# Altium project Rus.PrjPcb (part 1 of 2)
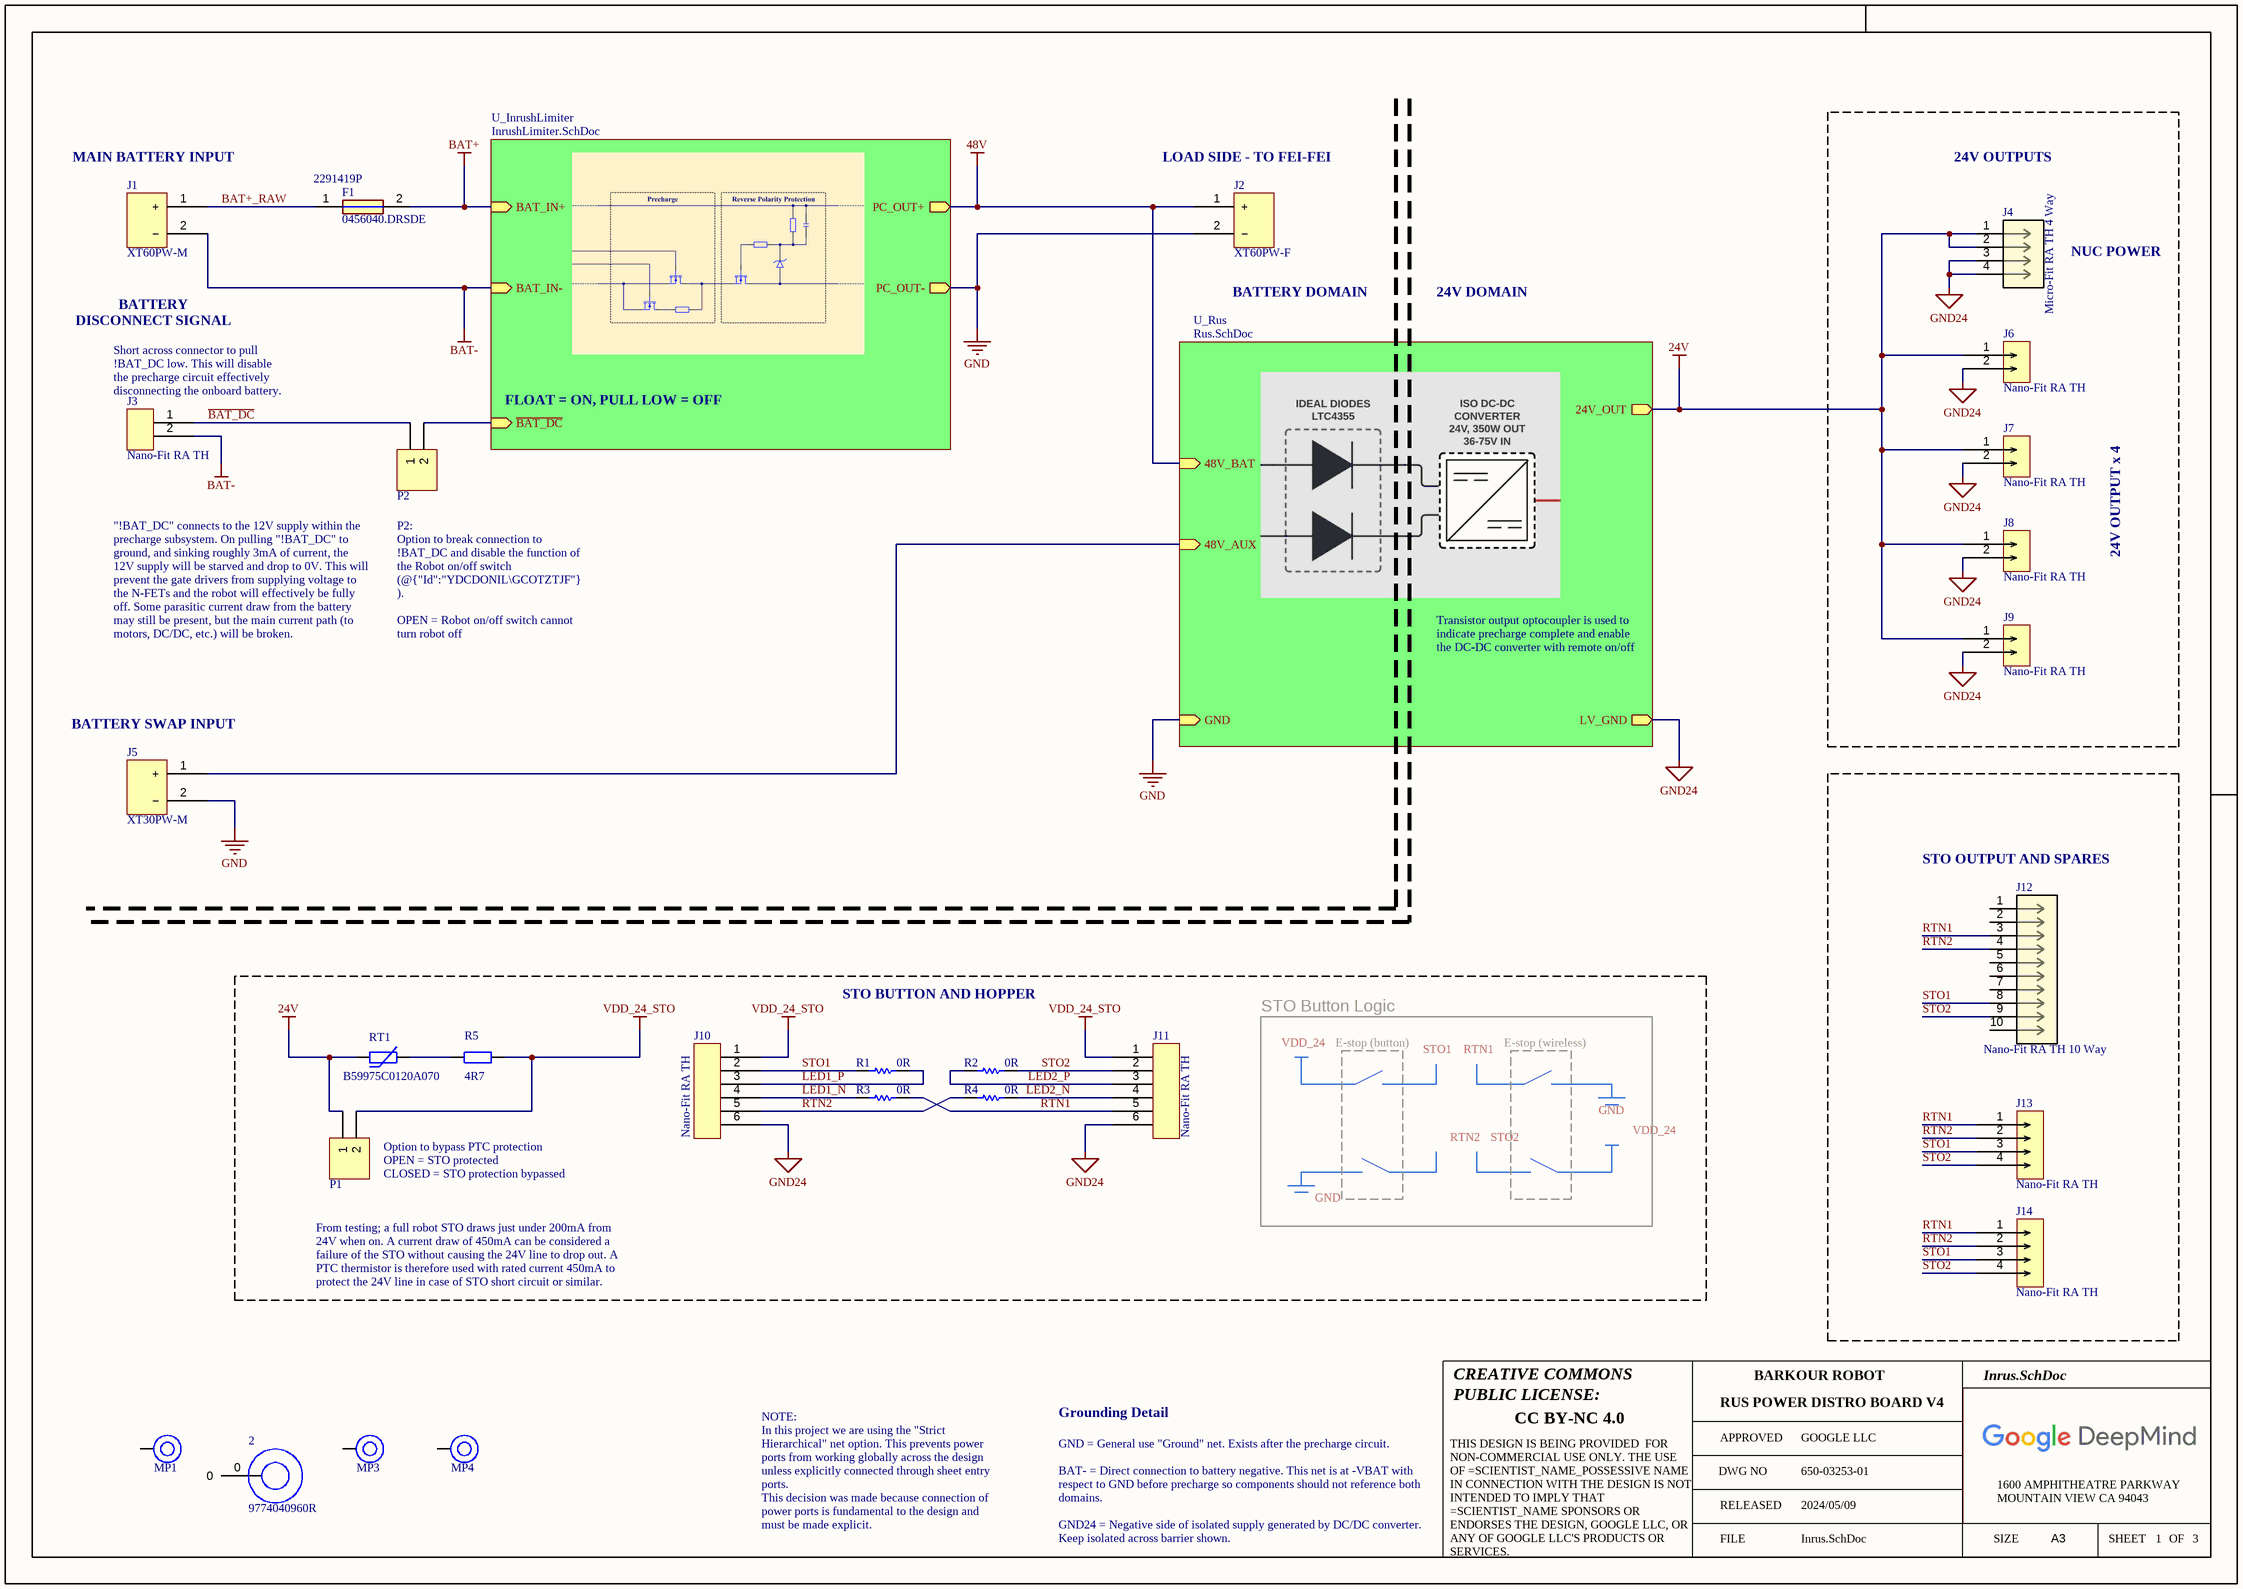
[diagram p0: Inrus.SchDoc]
Scientist_Name_Possessive: DANIELA RUS'S; Scientist_Name: DANIELA RUS; PROJECT_NAME: RUS POWER DISTRO BOARD V4; GPN_PCBA: 650-03253-01
3 sheets, 111 parts. Net scope: strictly hierarchical (ports join the sheet entries above them; power ports are local).
Board file: Rus.PcbDoc
Sheets:
  Inrus.SchDoc
    U_InrushLimiter = InrushLimiter.SchDoc
    U_Rus = Rus.SchDoc

## Sheet Inrus.SchDoc
size 420 x 297 mm; SheetNumber: 1; SheetTotal: 3

### Parts
2  9774040960R  [9774040960R]
F1  0456040.DRSDE  Supplier Part Number 1: 2291419P  [FUSC12245X450N]
J1  XT60PW-M  [XT60PW_M]
J2  XT60PW-F  [XT60PW_F]
J3  Colloquial: Nano-Fit RA TH  [MOLEX 1053131102]  (hidden comment: 105313-1202)
J4  Colloquial: Micro-Fit RA TH 4 Way  [MOLEX 430450401]  (hidden comment: 430450401)
J5  XT30PW-M  [XT30PW_M]
J6  Colloquial: Nano-Fit RA TH  [MOLEX 1053131102]  (hidden comment: 105313-1202)
J7  Colloquial: Nano-Fit RA TH  [MOLEX 1053131102]  (hidden comment: 105313-1202)
J8  Colloquial: Nano-Fit RA TH  [MOLEX 1053131102]  (hidden comment: 105313-1202)
J9  Colloquial: Nano-Fit RA TH  [MOLEX 1053131102]  (hidden comment: 105313-1202)
J10  Colloquial: Nano-Fit RA TH  [MOLEX 1053141206]  (hidden comment: 105314-1206)
J11  Colloquial: Nano-Fit RA TH  [MOLEX 1053141206]  (hidden comment: 105314-1206)
J12  Colloquial: Nano-Fit RA TH 10 Way  [MOLEX 1053141110]  (hidden comment: 1053141310)
J13  Colloquial: Nano-Fit RA TH  [MOLEX 1053141204]  (hidden comment: 105314-1204)
J14  Colloquial: Nano-Fit RA TH  [MOLEX 1053141204]  (hidden comment: 105314-1204)
MP1  M3 x 4mm  [9774040360]  (value not drawn)
MP3  M3 x 4mm  [9774040360]  (value not drawn)
MP4  M3 x 4mm  [9774040360]  (value not drawn)
P1  Header 2  [HDR1X2]  (value not drawn)
P2  Header 2  [HDR1X2]  (value not drawn)
R1  Resistance: 0R  [RESC1608X55X25ML10T15]  (hidden comment: RC0603JR-070RL)
R2  Resistance: 0R  [RESC1608X55X25ML10T15]  (hidden comment: RC0603JR-070RL)
R3  Resistance: 0R  [RESC1608X55X25ML10T15]  (hidden comment: RC0603JR-070RL)
R4  Resistance: 0R  [RESC1608X55X25ML10T15]  (hidden comment: RC0603JR-070RL)
R5  4R7  [RES 2512_6432]
RT1  B59975C0120A070  [RES THERM TH 9.0x12.5 DISC LEADED]

### Blocks framed on the sheet
STO OUTPUT AND SPARES: J12-J14
STO Button Logic: J10 J11 P1 R1-R5 RT1

### Sub-sheets
U_InrushLimiter = InrushLimiter.SchDoc: BAT_IN+ (in), BAT_IN- (in), PC_OUT+ (out), PC_OUT- (out), ~{BAT_DC} (in)
U_Rus = Rus.SchDoc: 48V_BAT (in), 48V_AUX (in), 24V_OUT (out), LV_GND (out), GND (in)

### Nets
24V: J4.1 J4.2 J6.1 J7.1 J8.1 J9.1 P1.1 RT1.1 ; sheet U_Rus/24V_OUT
48V: F1.2 J2.1(+) ; sheet U_InrushLimiter/BAT_IN+, sheet U_InrushLimiter/PC_OUT+, sheet U_Rus/48V_BAT  [also labelled BAT+]
48V_IN_2: J5.1(+) ; sheet U_Rus/48V_AUX
BAT-: J1.2(−) J3.2 ; sheet U_InrushLimiter/BAT_IN-
GND: J2.2(−) J5.2(−) ; sheet U_InrushLimiter/PC_OUT-, sheet U_Rus/GND
GND24: J4.3 J4.4 J6.2 J7.2 J8.2 J9.2 J10.6 J11.6 ; sheet U_Rus/LV_GND
VDD_24_STO: J10.1 J11.1 P1.2 R5.2
~{BAT_DC}: J3.1 P2.1
BAT+_RAW: F1.1 J1.1(+)
LED1_N: J10.4 R3.2
LED1_P: J10.3 R1.1
LED2_N: J11.4 R4.2
LED2_P: J11.3 R2.1
RTN1: J11.5 J12.3 J13.1 J14.1 R3.1
RTN2: J10.5 J12.4 J13.2 J14.2 R4.1
STO1: J10.2 J12.8 J13.3 J14.3 R1.2
STO2: J11.2 J12.9 J13.4 J14.4 R2.2
NetD202_3: P2.2 ; sheet U_InrushLimiter/~{BAT_DC}
NetR5_1: R5.1 RT1.2

Not connected (* = marked no-connect by the designer): 2 0; J12 1 2 5 6 7 10; MP1 1; MP3 1; MP4 1

### Notes on the sheet
- (near J1) MAIN BATTERY INPUT
- (near J2) LOAD SIDE - TO FEI-FEI
- 24V OUTPUTS
- NUC POWER
- BATTERY DOMAIN
- 24V DOMAIN
- BATTERY DISCONNECT SIGNAL
- (near J3) Short across connector to pull !BAT_DC low. This will disable the precharge circuit effectively disconnecting the onboard battery.
- FLOAT = ON, PULL LOW = OFF
- 24V OUTPUT x 4
- "!BAT_DC" connects to the 12V supply within the precharge subsystem. On pulling "!BAT_DC" to ground, and sinking roughly 3mA of current, the 12V supply will be starved and drop to 0V. This will prevent the gate drivers from supplying voltage to the N-FETs and the robot will effectively be fully off. Some parasitic current draw from the battery may still be present, but the main current path (to motors, DC/DC, etc.) will be broken.
- P2:
  Option to break connection to !BAT_DC and disable the function of the Robot on/off switch (@{"Id":"YDCDONIL\GCOTZTJF"} ).
  OPEN = Robot on/off switch cannot turn robot off
  CLOSED (default) = Robot on/off switch functional
- (near J5) BATTERY SWAP INPUT
- Transistor output optocoupler is used to indicate precharge complete and enable the DC-DC converter with remote on/off
- STO BUTTON AND HOPPER
- VDD_24
- E-stop (button)
- STO1
- RTN1
- E-stop (wireless)
- GND
- (near P1) Option to bypass PTC protection
  OPEN = STO protected
  CLOSED = STO protection bypassed
- RTN2
- STO2
- From testing; a full robot STO draws just under 200mA from 24V when on. A current draw of 450mA can be considered a failure of the STO without causing the 24V line to drop out. A PTC thermistor is therefore used with rated current 450mA to protect the 24V line in case of STO short circuit or similar.
- Grounding Detail
- NOTE:
  In this project we are using the "Strict Hierarchical" net option. This prevents power ports from working globally across the design unless explicitly connected through sheet entry ports.
  This decision was made because connection of power ports is fundamental to the design and must be made explicit.
- GND = General use "Ground" net. Exists after the precharge circuit.
  BAT- = Direct connection to battery negative. This net is at -VBAT with respect to GND before precharge so components should not reference both domains.
  GND24 = Negative side of isolated supply generated by DC/DC converter. Keep isolated across barrier shown.
- CREATIVE COMMONS
- PUBLIC LICENSE:
- BARKOUR ROBOT
- CC BY-NC 4.0
- APPROVED
- DWG NO
- GOOGLE LLC
- FILE
- RELEASED
- 2024/05/09
- SIZE
- 1600 AMPHITHEATRE PARKWAY
- MOUNTAIN VIEW CA 94043
- A3
- SHEET
- OF
- THIS DESIGN IS BEING PROVIDED  FOR NON-COMMERCIAL USE ONLY. THE USE OF =SCIENTIST_NAME_POSSESSIVE NAME IN CONNECTION WITH THE DESIGN IS NOT INTENDED TO IMPLY THAT =SCIENTIST_NAME SPONSORS OR ENDORSES THE DESIGN, GOOGLE LLC, OR ANY OF GOOGLE LLC'S PRODUCTS OR SERVICES.

### Library data of the parts
2 = 9774040960R: Spacer Material: Steel Mounting: SMT Series: WA-SMST For ø: 3.3 mm; Manufacturer: Wurth Electronics; Plating: Tin; Threaded/Unthreaded: Unthreaded; Inside Diameter: 0.13inch; Outside Diameter: 0.236inch; Supplier 1: Digi-Key; Manufacturer Part Number: 9774040960R; RoHS: Yes; Category: Spacers, Standoffs; Stock 1: 190; Pricing 1: 1=1.79000, 10=1.71600, 50=1.50700, 100=1.40200 (USD); Material: Steel; Length: 0.213inch; REACH SVHC: Unknown; ComponentLink1URL: http://www.farnell.com/datasheets/1960394.pdf?src-supplier=Farnell; ComponentLink1Description: http://www.farnell.com/datasheets/1960394.pdf?src-supplier=Farnell; ComponentLink2URL: http://www.mouser.com/ds/2/445/9774040960R-611108.pdf?src-supplier=Mouser; ComponentLink2Description: http://www.mouser.com/ds/2/445/9774040960R-611108.pdf?src-supplier=Mouser; ComponentLink3URL: https://media.digikey.com/pdf/Data%20Sheets/Wurth%20Electronics%20PDFs/WA-SMSx_Performance_Flyer.pdf?src-supplier=Digi-Key; ComponentLink3Description: https://media.digikey.com/pdf/Data%20Sheets/Wurth%20Electronics%20PDFs/WA-SMSx_Performance_Flyer.pdf?src-supplier=Digi-Key; ComponentLink4URL: http://www.farnell.com/datasheets/1960394.pdf?src-supplier=Element14; ComponentLink4Description: http://www.farnell.com/datasheets/1960394.pdf?src-supplier=Element14; ComponentLink5URL: http://www.farnell.com/datasheets/1960394.pdf?src-supplier=Newark; ComponentLink5Description: http://www.farnell.com/datasheets/1960394.pdf?src-supplier=Newark; Supplier Part Number 1: 732-7092-1-ND
F1 = 0456040.DRSDE: Electric Fuse, Fast Blow, 40A, 250VAC, 80VDC, 150A (IR), Surface Mount, NANO; Manufacturer_Name: LITTELFUSE; Datasheet Link: https://www.littelfuse.com/~/media/electronics/datasheets/fuses/littelfuse_fuse_456sde_datasheet.pdf.pdf; Height: 4.5mm; Manufacturer_Part_Number: 0456040.DRSDE; Mouser Part Number: 576-0456040.DRSDE; Mouser Price/Stock: https://www.mouser.co.uk/ProductDetail/Littelfuse/0456040.DRSDE?qs=iLbezkQI%252Bsg1J2n4oyxfKg%3D%3D; Supplier 1: Rs; Manufacturer: Littelfuse; Manufacturer Part Number: 0456040.DRSDE; RoHS: Yes; Category: Fuses; Stock 1: 1372; Pricing 1: 50=3.055, 100=2.55, 250=2.475, 500=2.115 (GBP)
J1 = XT60PW-M: Amass XT60 RA TH male header; Manufacturer: Amass; Manufacturer Part Number: XT60PW-M
J2 = XT60PW-F: Amass XT60 RA TH female header; Manufacturer: Amass; Manufacturer Part Number: XT60PW-F
J3 J6-J9 = Nano-Fit RA TH 2 Way Header: Nano-Fit Right Angle Header; Through Hole; 2.50mm; Single Row; 2 Circuit; Gold Plated; Manufacturer: Molex; Gender: Male; Supplier 1: RSComponents; Manufacturer Part Number: 105313-1202; RoHS: Yes; Category: Headers and Wire Housings; Stock 1: 621; Pricing 1: 10=1.38000 (GBP); Mount: Through Hole; Contact Plating: Gold; Contact Material: Brass; Color: Black; Termination: Through Hole; Number of Rows: 1; REACH SVHC: Unknown; RoHS Compliant: Yes; Supplier Part Number 1: 1225087
J4 = Micro-Fit RA TH 4 Way Header Dual Row: Header, 2 Row, Right-Angle, Snap-In Lock, 4 Pin, Gold Plate, SMT/Glow Wire Compatible; Manufacturer: Molex; Copyright: Copyright (C) 2022 Ultra Librarian. All rights reserved.; Manufacturer Part Number: 430450401; RefDes: RefDes; Type: DEV; Supplier 1: RSComponents; RoHS: Yes; Category: Headers and Wire Housings; Stock 1: 2315; Pricing 1: 5=1.54600, 100=1.21000, 375=1.08600, 1500=0.86200, 3000=0.80000 (GBP); ComponentLink1URL: https://datasheet.ciiva.com/5153/0430450401-pcb-headers-142810-5153780.pdf?src-supplier=Mouser; ComponentLink1Description: https://datasheet.ciiva.com/5153/0430450401-pcb-headers-142810-5153780.pdf?src-supplier=Mouser; ComponentLink2URL: https://datasheet.ciiva.com/31838/151680430450401-pcb-headers-31838471.pdf?src-supplier=Onlinecomponents.com; ComponentLink2Description: https://datasheet.ciiva.com/31838/151680430450401-pcb-headers-31838471.pdf?src-supplier=Onlinecomponents.com; ComponentLink3URL: https://datasheet.ciiva.com/11749/0900766b80d483ee-11749369.pdf?src-supplier=RSComponents; ComponentLink3Description: https://datasheet.ciiva.com/11749/0900766b80d483ee-11749369.pdf?src-supplier=RSComponents; ComponentLink4URL: https://datasheet.ciiva.com/10090/0430450401-pcb-headers-10090512.pdf?src-supplier=Avnet; ComponentLink4Description: https://datasheet.ciiva.com/10090/0430450401-pcb-headers-10090512.pdf?src-supplier=Avnet; ComponentLink5URL: https://datasheet.ciiva.com/1443/1780486-1443445.pdf?src-supplier=Element14; ComponentLink5Description: https://datasheet.ciiva.com/1443/1780486-1443445.pdf?src-supplier=Element14; Supplier Part Number 1: 6700321
J5 = XT30PW-M: Amass XT30 RA TH male header; Manufacturer: Amass; Manufacturer Part Number: XT30PW-M
J10 J11 = Nano-Fit RA TH 6 Way Header Dual Row: Nano-Fit Right Angle Header; Through Hole; 2.50mm; Dual Row; 6 Circuit; Gold Plated; Manufacturer: Molex; Gender: Male; Manufacturer Part Number: 105314-1206; RoHS: Yes; Category: Headers and Wire Housings; Stock 1: 621; Pricing 1: 10=1.38000 (GBP); Mount: Through Hole; Contact Plating: Gold; Contact Material: Brass; Color: Black; Termination: Through Hole; Number of Rows: 2; REACH SVHC: Unknown; RoHS Compliant: Yes; Supplier 1: Farnell; Supplier Part Number 1: 2576871
J12 = Nano-Fit RA TH 10 Way Header: Nano-Fit Right Angle Header; Through Hole; 2.50mm; Dual Row; 10 Circuit; Gold Plating; Manufacturer: Molex; Copyright: Copyright (C) 2022 Ultra Librarian. All rights reserved.; Manufacturer Part Number: 1053141310; RefDes: RefDes; Type: DEV
J13 J14 = Nano-Fit RA TH 4 Way Header Dual Row: Nano-Fit Right Angle Header; Through Hole; 2.50mm; Dual Row; 4 Circuit; Gold Plated; Manufacturer Part Number: 105314-1204
MP1 MP3 MP4 = 9774040360R: WA-SMSI SMT Steel Spacer with internal Thread, OD 6mm, M3 x 4mm; Manufacturer: Wurth Elektronik; Inside Diameter: 4.2mm; Surface: Tin; ComponentLink1Description: Website Link; ComponentLink1URL: https://www.we-online.com/redexpert/article/9774040360R?ad; ComponentLink2Description: Datasheet Link; ComponentLink2URL: https://www.we-online.com/redexpert/spec/9774040360R?ad; Manufacturer Part Number: 9774040360R; Category: SMT Spacers; Match Code: WA-SMSI; Mount: Surface Mount; Operating Temperature Max: 150°C; Operating Temperature Min: -55°C; Packaging: Tape and Reel; Height: 4mm; Material: Steel; Outside Diameter: 6mm; Thread Size: M3
P1 P2 = Header 2: Header, 2-Pin; LatestRevisionDate: 17-Jul-2002; LatestRevisionNote: Re-released for DXP Platform.; Publisher: Altium Limited
R1-R4 = CMP-2100-03667-1: Chip Resistor, 0 Ohm, +/- 5%, 0.1 W, -55 to 155 degC, 0603 (1608 Metric), RoHS, Tape and Reel; Manufacturer: Yageo; Temperature Coefficient: 200ppm/degreesC; Voltage Rating: 50V; Power Rating: 100mW; Width: 0.8mm; Max Operating Temperature: 155degC; Tolerance: 5%; Package Reference: 0603; Height: 0.45mm; Depth: 0.8mm; Package Description: 2-Pin Surface Mount Device, Body 1.6 x 0.8 mm; Termination: SMD/SMT; Package Quantity: 5000; Case/Package: 0603; Case Code (Imperial): 0603; Radiation Hardening: No; Number of Pins: 2; Length: 1.6mm; Lead Free: LeadFree; Voltage Rating (DC): 50V; Military Standard: Not; Datasheet URL: http://www.yageo.com/NewPortal/yageodocoutput?fileName=/pdf/R-Chip/PYu-RC_Group_51_RoHS_L_5.pdf; Manufacturer URL: http://www.yageo.com/; Packaging: TapeandReel; Case Code (Metric): 1608; Min Operating Temperature: -55degC; Composition: ThickFilm; RoHSCompliant: true; Contact Plating: Tin; Datasheet Version: Rev. 5, 10/2016; REACH SVHC: NoSVHC
R5 = R: Generic Resistor; Tolerance: 1%; Voltage Rating: 200V; Power Rating: 1000mW; Temperature Coefficient: 100ppm/°C; Size Code: 2512; Resistance: 4R7
RT1 = B59975C0120A070: Thermistor PTC 1.8 Ohm 25% 2-Pin Radial Cardboard Strip; Manufacturer: Epcos; Max Supply Voltage: 30V; Lead Length: 25mm; Manufacturer Part Number: B59975C0120A070; Supplier 1: Farnell; RoHS: Yes; Category: PTC Resettable Fuses; Stock 1: 1677; Pricing 1: 1=1.56000, 10=1.23000, 50=0.92700, 100=0.83300, 200=0.72800, 500=0.62200, 2500=0.61000 (GBP); Mount: Through Hole; Case/Package: Radial; Number of Pins: 2; Contact Plating: Tin; Min Operating Temperature: -40°C; Max Operating Temperature: 125°C; Packaging: Strip; Tolerance: 25%; Operating Supply Voltage: 30V; Width: 9mm; Height: 12.5mm; Depth: 3.5mm; Thickness: 3.5mm; Radiation Hardening: No; REACH SVHC: No SVHC; Lead Free: Lead Free; RoHS Compliant: Yes; ComponentLink1URL: https://datasheet.ciiva.com/15097/getdatasheetpartid-382302-15097925.pdf?src-supplier=Verical; ComponentLink1Description: https://datasheet.ciiva.com/15097/getdatasheetpartid-382302-15097925.pdf?src-supplier=Verical; ComponentLink2URL: https://datasheet.ciiva.com/48779/1899685-48779500.pdf?src-supplier=Element14; ComponentLink2Description: https://datasheet.ciiva.com/48779/1899685-48779500.pdf?src-supplier=Element14; Supplier Part Number 1: 9753087

## Sheet InrushLimiter.SchDoc
size 420 x 297 mm; SheetNumber: 2; SheetTotal: 3
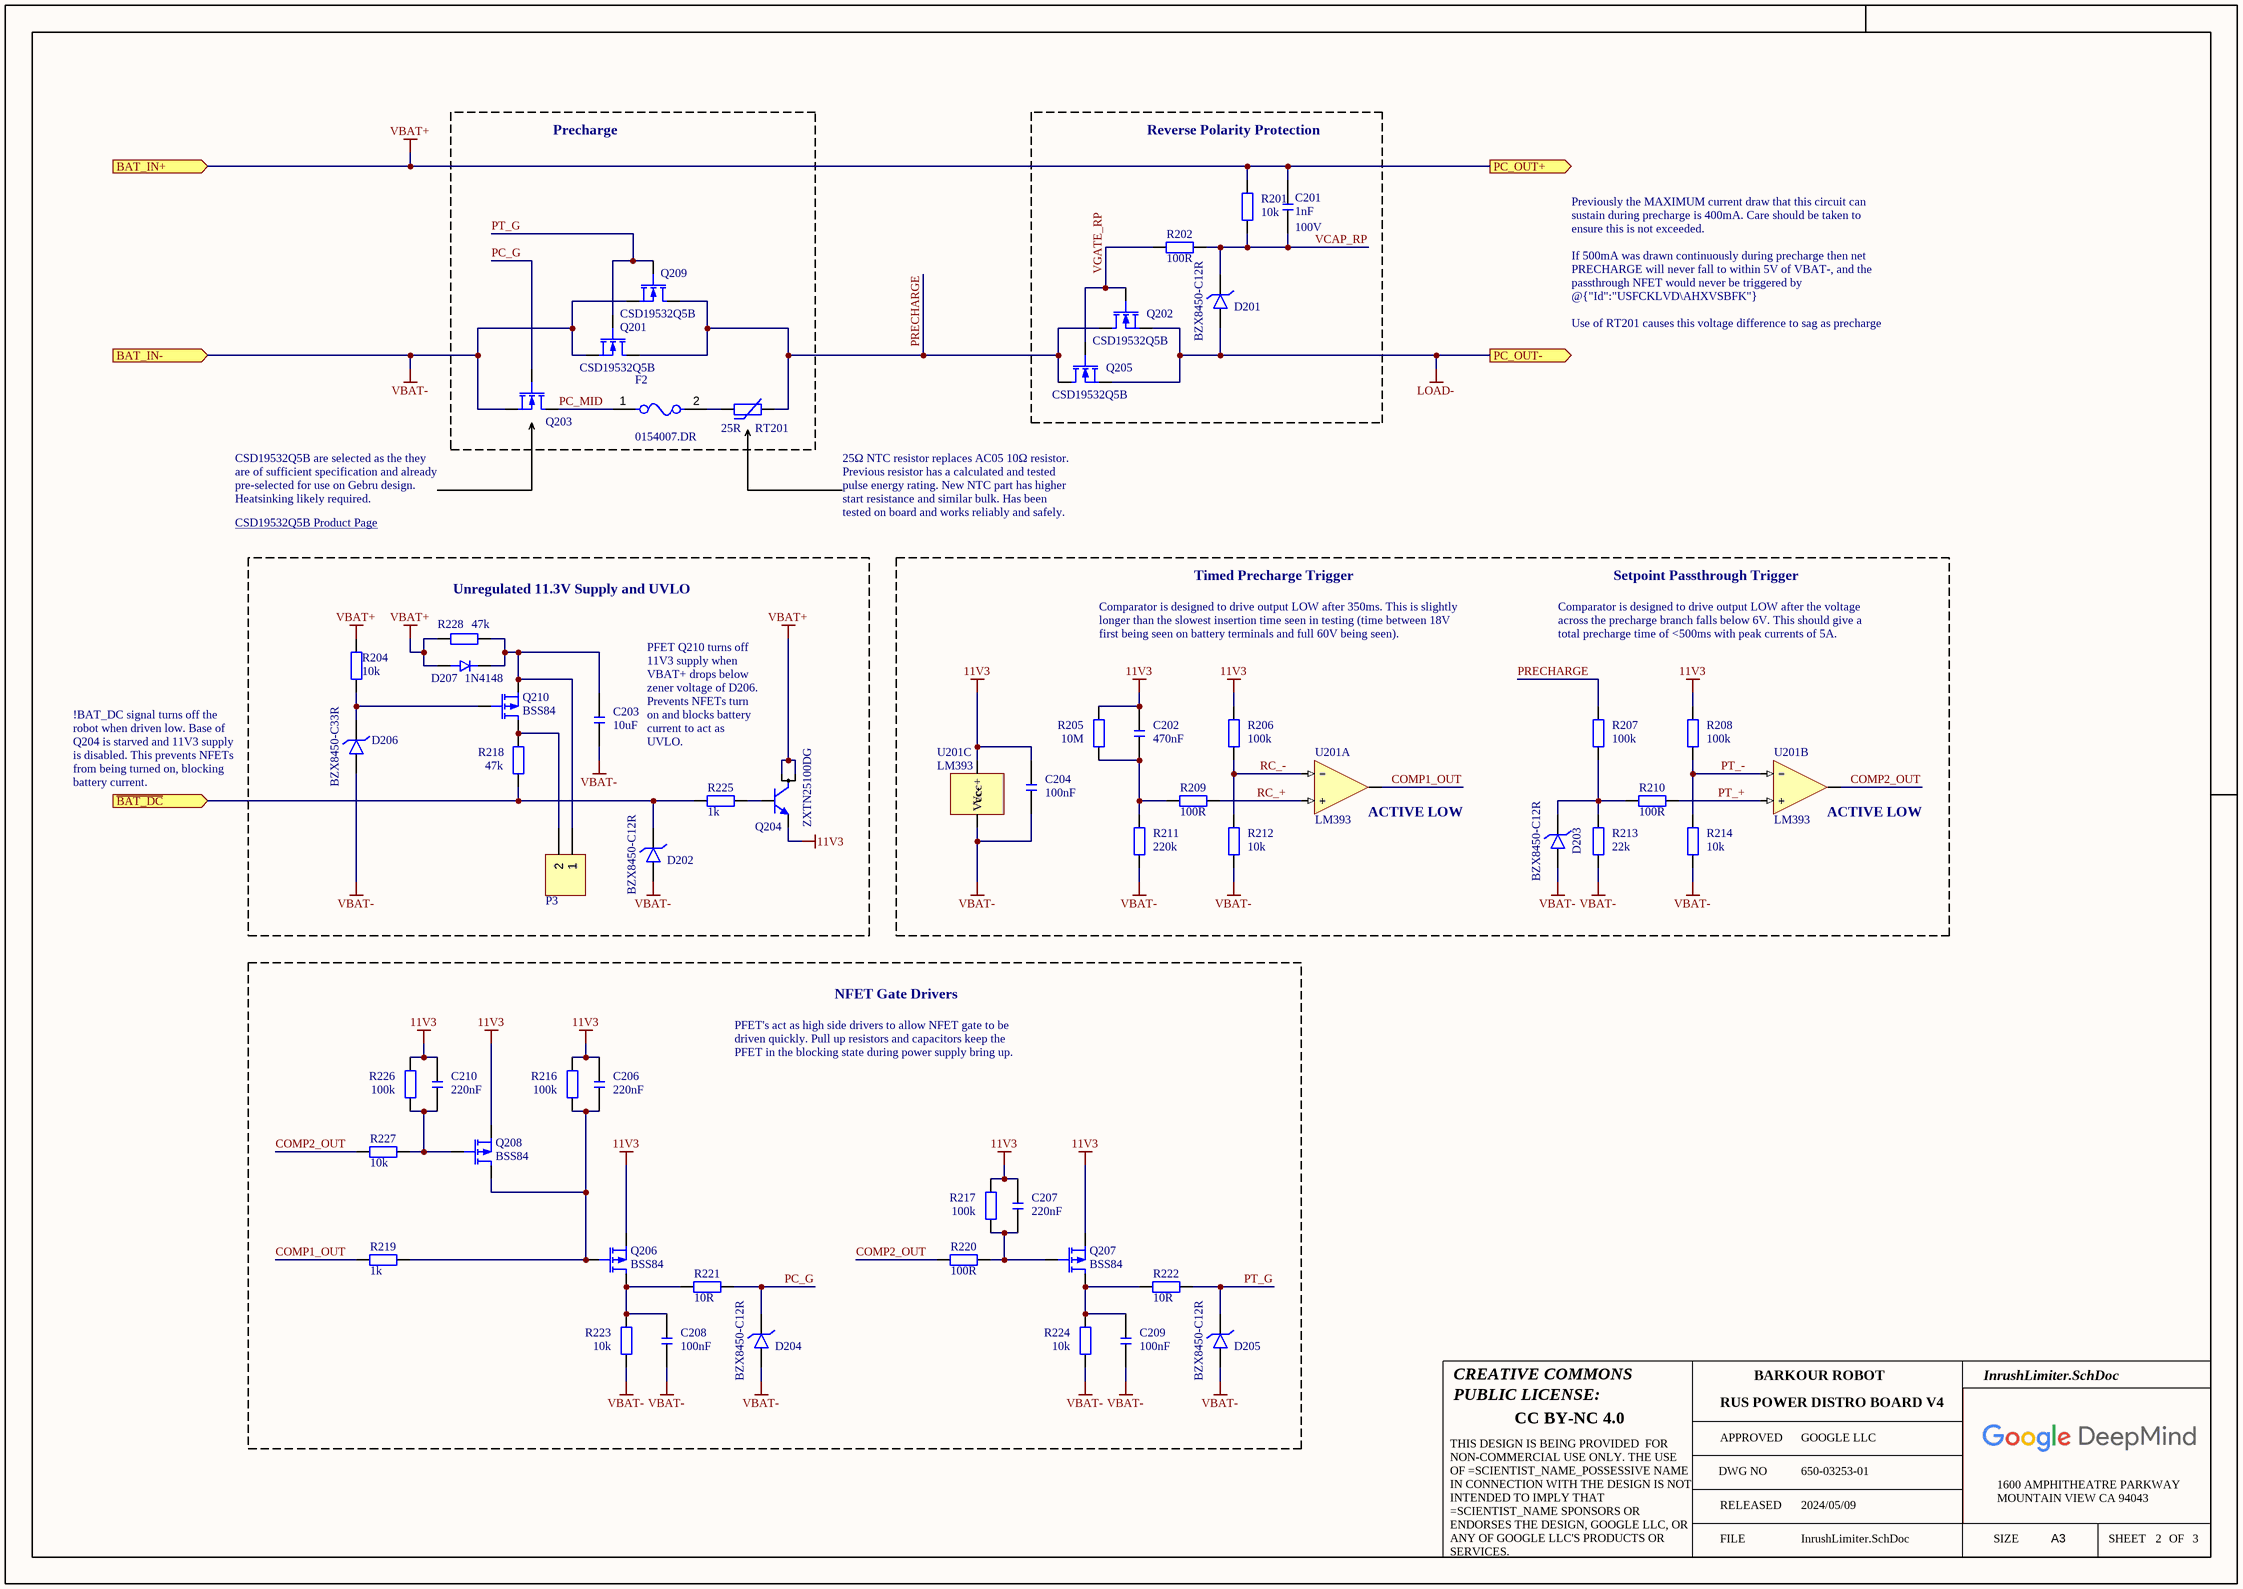
[diagram p1: InrushLimiter.SchDoc]

### Parts
C201  1nF  Voltage Rating: 100V  [CAP 0805_2012]
C202  470nF  [CAP 0603_1608 RF]
C203  10uF  [CAP 1206_3216]
C204  100nF  [CAP 0603_1608 RF]
C206  220nF  [CAP 0603_1608 RF]
C207  220nF  [CAP 0603_1608 RF]
C208  100nF  [CAP 0603_1608 RF]
C209  100nF  [CAP 0603_1608 RF]
C210  220nF  [CAP 0603_1608 RF]
D201  BZX8450-C12R  [NEXPERIA SOT-23-3]
D202  BZX8450-C12R  [NEXPERIA SOT-23-3]
D203  BZX8450-C12R  [NEXPERIA SOT-23-3]
D204  BZX8450-C12R  [NEXPERIA SOT-23-3]
D205  BZX8450-C12R  [NEXPERIA SOT-23-3]
D206  BZX8450-C33R  [NEXPERIA SOT-23-3]
D207  1N4148WS-7-F  [SOD323]  (value not drawn)
F2  0154007.DR  [FP-0154-MFG]
P3  Header 2  [HDR1X2]  (value not drawn)
Q201  CSD19532Q5B  [TI SON 5x6]
Q202  CSD19532Q5B  [TI SON 5x6]
Q203  CSD19532Q5B  [TI SON 5x6]  (value not drawn)
Q204  ZXTN25100DG  [DIODES SOT-223]
Q205  CSD19532Q5B  [TI SON 5x6]
Q206  Colloquial: BSS84  [DIODES SOT-323-3]  (hidden comment: BSS84W-7-F)
Q207  Colloquial: BSS84  [DIODES SOT-323-3]  (hidden comment: BSS84W-7-F)
Q208  Colloquial: BSS84  [DIODES SOT-323-3]  (hidden comment: BSS84W-7-F)
Q209  CSD19532Q5B  [TI SON 5x6]
Q210  Colloquial: BSS84  [DIODES SOT-323-3]  (hidden comment: BSS84W-7-F)
R201  10k  [RES 0402_1005 RF]
R202  100R  [RES 0402_1005 RF]
R204  10k  [RES 0603_1608 RF]
R205  10M  [RES 0402_1005 RF]
R206  100k  [RES 0402_1005 RF]
R207  100k  [RES 0402_1005 RF]
R208  100k  [RES 0402_1005 RF]
R209  100R  [RES 0402_1005 RF]
R210  100R  [RES 0402_1005 RF]
R211  220k  [RES 0402_1005 RF]
R212  10k  [RES 0402_1005 RF]
R213  22k  [RES 0603_1608 RF]
R214  10k  [RES 0402_1005 RF]
R216  100k  [RES 0402_1005 RF]
R217  100k  [RES 0402_1005 RF]
R218  47k  [RES 0603_1608 RF]
R219  1k  [RES 0402_1005 RF]
R220  100R  [RES 0402_1005 RF]
R221  10R  [RES 0402_1005 RF]
R222  10R  [RES 0402_1005 RF]
R223  10k  [RES 0402_1005 RF]
R224  10k  [RES 0402_1005 RF]
R225  1k  [RES 0603_1608 RF]
R226  100k  [RES 0402_1005 RF]
R227  10k  [RES 0402_1005 RF]
R228  47k  [RES 0603_1608 RF]
RT201  value 25R  [RES THERM TH 16.0 DISC LEADED]  (hidden comment: B57238S0250M000)
U201  LM393PT  [ST TSSOP-8]  (value not drawn)  (parts A,B,C of 3)

### Blocks framed on the sheet
Precharge: F2 Q201 Q203 Q209 RT201
Reverse Polarity Protection: C201 D201 Q202 Q205 R201 R202
Unregulated 11.3V Supply and UVLO: C203 D202 D206 D207 P3 Q204 Q210 R204 R218 R225 R228
NFET Gate Drivers: C206-C210 D204 D205 Q206-Q208 R216 R217 R219-R224 R226 R227

### Ports
BAT_IN+ (in), BAT_IN- (in), PC_OUT+ (out), PC_OUT- (out), ~{BAT_DC} (in)

### Nets
11V3: C202.2 C204.2 C206.2 C207.2 C210.2 Q204.3(E) Q206.3(S) Q207.3(S) Q208.3(S) R205.2 R206.2 R208.2 R216.1 R217.1 R226.1 U201.8(Vcc+)
LOAD-: D201.1(A) Q202.2(S) Q205.2(S) ; port PC_OUT-  [project net GND]
VBAT+: C201.2 D207.1 Q204.2(C) Q204.4(C) R201.2 R204.1 R228.2 ; port BAT_IN+, port PC_OUT+  [project net 48V]
VBAT-: C203.1 C204.1 C208.1 C209.1 D202.1(A) D203.1(A) D204.1(A) D205.1(A) D206.1(A) Q201.2(S) Q203.2(S) Q209.2(S) R211.1 R212.1 R213.1 R214.1 R223.2 R224.2 U201.4(Vcc-) ; port BAT_IN-  [project net BAT-]
COMP1_OUT: R219.2 U201.1(Out1)
COMP2_OUT: R220.2 R227.2 U201.7(Out1)
PC_G: D204.3(K) Q203.1(G) R221.1
PC_MID: F2.1 Q203.3(D)
PRECHARGE: Q201.3(D) Q202.3(D) Q205.3(D) Q209.3(D) R207.2 RT201.2
PT_+: R210.1 U201.5(+)
PT_-: R208.1 R214.2 U201.6(−)
PT_G: D205.3(K) Q201.1(G) Q209.1(G) R222.1
RC_+: R209.1 U201.3(+)
RC_-: R206.1 R212.2 U201.2(−)
VCAP_RP: C201.1 D201.3(K) R201.1 R202.1
VGATE_RP: Q202.1(G) Q205.1(G) R202.2
NetC202_1: C202.1 R205.1 R209.2 R211.2
NetC203_2: C203.2 D207.2 P3.1 Q210.3(S) R228.1
NetC206_1: C206.1 Q206.1(G) Q208.2(D) R216.2 R219.1
NetC207_1: C207.1 Q207.1(G) R217.2 R220.1
NetC208_2: C208.2 Q206.2(D) R221.2 R223.1
NetC209_2: C209.2 Q207.2(D) R222.2 R224.1
NetC210_1: C210.1 Q208.1(G) R226.2 R227.1
NetD202_3: D202.3(K) R218.1 R225.2 ; port ~{BAT_DC}
NetD203_3: D203.3(K) R207.1 R210.2 R213.2
NetD206_3: D206.3(K) Q210.1(G) R204.2
NetF2_2: F2.2 RT201.1
NetP3_2: P3.2 Q210.2(D) R218.2
NetQ204_1: Q204.1(B) R225.1

### Notes on the sheet
- Previously the MAXIMUM current draw that this circuit can sustain during precharge is 400mA. Care should be taken to ensure this is not exceeded.
  If 500mA was drawn continuously during precharge then net PRECHARGE will never fall to within 5V of VBAT-, and the passthrough NFET would never be triggered by @{"Id":"USFCKLVD\AHXVSBFK"}
  Use of RT201 causes this voltage difference to sag as precharge continues, providing resiliency against this failure mode.
- CSD19532Q5B are selected as the they are of sufficient specification and already pre-selected for use on Gebru design. Heatsinking likely required.
- CSD19532Q5B Product Page <https://www.ti.com/product/CSD19532Q5B>
- 25Ω NTC resistor replaces AC05 10Ω resistor. Previous resistor has a calculated and tested pulse energy rating. New NTC part has higher start resistance and similar bulk. Has been tested on board and works reliably and safely.
- Timed Precharge Trigger
- Setpoint Passthrough Trigger
- Comparator is designed to drive output LOW after 350ms. This is slightly longer than the slowest insertion time seen in testing (time between 18V first being seen on battery terminals and full 60V being seen).
- Comparator is designed to drive output LOW after the voltage across the precharge branch falls below 6V. This should give a total precharge time of <500ms with peak currents of 5A.
- PFET Q210 turns off 11V3 supply when VBAT+ drops below zener voltage of D206. Prevents NFETs turn on and blocks battery current to act as UVLO.
- !BAT_DC signal turns off the robot when driven low. Base of Q204 is starved and 11V3 supply is disabled. This prevents NFETs from being turned on, blocking battery current.
- (near U201) ACTIVE LOW
- PFET's act as high side drivers to allow NFET gate to be driven quickly. Pull up resistors and capacitors keep the PFET in the blocking state during power supply bring up.
- CREATIVE COMMONS
- PUBLIC LICENSE:
- BARKOUR ROBOT
- CC BY-NC 4.0
- APPROVED
- DWG NO
- GOOGLE LLC
- FILE
- RELEASED
- 2024/05/09
- SIZE
- 1600 AMPHITHEATRE PARKWAY
- MOUNTAIN VIEW CA 94043
- A3
- SHEET
- OF
- THIS DESIGN IS BEING PROVIDED  FOR NON-COMMERCIAL USE ONLY. THE USE OF =SCIENTIST_NAME_POSSESSIVE NAME IN CONNECTION WITH THE DESIGN IS NOT INTENDED TO IMPLY THAT =SCIENTIST_NAME SPONSORS OR ENDORSES THE DESIGN, GOOGLE LLC, OR ANY OF GOOGLE LLC'S PRODUCTS OR SERVICES.

### Library data of the parts
C201 = C: Generic Capacitor; Tolerance: 20%; Temperature Coefficient: X7R; Capacitance: 1nF; Size Code: 0805
C202 C204 C206-C210 = C: Generic Capacitor; Tolerance: 10%; Temperature Coefficient: X7R; Voltage Rating: 50V; Size Code: 0603
  C202: Capacitance: 470nF
  C204 C208 C209: Capacitance: 100nF
  C206 C207 C210: Capacitance: 220nF
C203 = C: Generic Capacitor; Tolerance: 10%; Temperature Coefficient: X7R; Voltage Rating: 25V; Capacitance: 10uF; Size Code: 1206
D201-D205 = BZX8450-C12R: Diode Zener Single 12V 5% 250mW 3-Pin SOT-23 T/R; Manufacturer: Nexperia; Manufacturer Part Number: BZX8450-C12R; Supplier 1: Newark; Stock 1: 2900; Pricing 1: 1=0.22000, 5=0.22000, 10=0.17900, 25=0.15100, 50=0.12200, 100=0.09400, 250=0.07800, 500=0.06200, 1000=0.04200 (USD); ComponentLink1URL: https://datasheet.octopart.com/BZX8450-C12R-Nexperia-datasheet-155371286.pdf?src-supplier=Farnell; ComponentLink1Description: https://datasheet.octopart.com/BZX8450-C12R-Nexperia-datasheet-155371286.pdf?src-supplier=Farnell; Supplier Part Number 1: 73AJ2261
D206 = BZX8450-C20R: Zener Diodes BZX8450-C33/SOT23/TO-236AB; Manufacturer: Nexperia; Manufacturer Part Number: BZX8450-C33R; Supplier 1: Farnell; RoHS: Yes; Category: Zener Diodes; Stock 1: 2750; Pricing 1: 5=0.182, 10=0.149, 100=0.079, 500=0.0517, 1000=0.0273, 5000=0.0268 (GBP); Supplier Part Number 1: 3810767
D207 = 1N4148: Signal Diode VR=75V IF=150mA Trr=4ns P=200mW; Manufacturer: Diodes; Reverse Recovery Time: 4ns; Forward Voltage: 1.25V; Average Rectified Current: 150mA; Max Repetitive Reverse Voltage (Vrrm): 75V; Element Configuration: Single; Forward Current: 300mA; Peak Non-Repetitive Surge Current: 2A; Power Dissipation: 200mW; Max Reverse Current: 1uA; Polarity: Standard; Capacitance: 2pF; Supplier 1: RSComponents; Manufacturer Part Number: 1N4148WS-7-F; RoHS: Yes; Category: Rectifier Diodes; Stock 1: 18000; Pricing 1: 3000=0.03600, 6000=0.03200, 12000=0.02900, 30000=0.02700, 60000=0.02300 (USD); Mount: Surface Mount; Number of Pins: 2; Weight: 0.000173oz; Contact Plating: Tin,Matte; Min Operating Temperature: -65°C; Max Operating Temperature: 150°C; Packaging: Tape and Reel; Max Reverse Voltage (DC): 75V; Recovery Time: 4ns; Package Quantity: 3000; Max Forward Surge Current (Ifsm): 2A; Series: -; Max Surge Current: 2A; Current Rating: 150mA; Voltage Rating (DC): 75V; Output Current: 150mA; Reverse Recovery Time-Max: 4ns; Power Rating: 200mW; Voltage: 75V; Length: 1.8mm; Width: 1.4mm; Height: 1mm; Radiation Hardening: No; Lead Free: Lead Free; RoHS Compliant: Yes; REACH SVHC: No SVHC; Supplier Part Number 1: 9228070; Colloquial: 1N4148
F2 = CMP-08605-000035-1: FUSE BRD MNT 7A 125VAC/VDC 2SMD; Manufacturer: Littelfuse Inc; Max Fuse Ac Voltage: 125V; Fuse Blow Speed: Fast; Manufacturer Part Number: 0154007.DR; Device Class L1: Circuit Protection; Octopart: https://octopart.com/0154007.dr-littelfuse-565863; RoHS: TRUE; Automotive: No; Category: Fuse; Device Class L3: unset; Fuse Current: 7A; Device Class L2: Fuses; Height: 3.81mm; Temperature: -55°C to +125°C; ComponentLink2URL: https://www.littelfuse.com/~/media/electronics/datasheets/fuses/littelfuse_fuse_154_154t_154l_154tl_datasheet.pdf.pdf; Digikey Description: FUSE BRD MNT 7A 125VAC/VDC 2SMD; Package: 0154; Max Fuse Dc Voltage: 125V; Temperature Range High: +125°C; Lead Free: Yes; ComponentLink2Description: Datasheet; Mouser Description: Surface Mount Fuses Fuseblock w/ fuse 7A OMNI BLOK 154; Temperature Range Low: -55°C
P3 = Header 2: Header, 2-Pin; LatestRevisionDate: 17-Jul-2002; LatestRevisionNote: Re-released for DXP Platform.; Publisher: Altium Limited
Q201-Q203 Q205 Q209 = CSD19532Q5B: 100-V, N channel NexFET™ power MOSFET, single SON 5 mm x 6 mm, 4.9 mOhm 8-VSON-CLIP -55 to 150; pin to pad: 1>4 2>1+2+3 3>5+6+7+8; Manufacturer: Texas Instruments; Rds On Max: 4.9mR; Input Capacitance: 4.81nF; Drain to Source Voltage (Vdss): 100V; Continuous Drain Current (ID): 100A; Max Power Dissipation: 3.1W; Rise Time: 6ns; Turn-On Delay Time: 7ns; Turn-Off Delay Time: 22ns; Gate to Source Voltage (Vgs): 20V; Threshold Voltage: 2.6V; Number of Elements: 1; ComponentLink2URL: https://assets.nexperia.com/documents/data-sheet/BSS138PS.pdf?src-supplier=Digi-Key; ComponentLink2Description: https://assets.nexperia.com/documents/data-sheet/BSS138PS.pdf?src-supplier=Digi-Key; Manufacturer Part Number: CSD19532Q5B; ComponentLink1URL: http://www.farnell.com/datasheets/1499179.pdf?src-supplier=Farnell; ComponentLink1Description: http://www.farnell.com/datasheets/1499179.pdf?src-supplier=Farnell; ComponentLink3URL: https://assets.nexperia.com/documents/data-sheet/2N7002.pdf?src-supplier=Digi-Key; ComponentLink3Description: https://assets.nexperia.com/documents/data-sheet/2N7002.pdf?src-supplier=Digi-Key; ComponentLink4URL: http://www.farnell.com/datasheets/1499179.pdf?src-supplier=Newark; ComponentLink4Description: http://www.farnell.com/datasheets/1499179.pdf?src-supplier=Newark; Supplier 1: Mouser; RoHS: Yes; Category: MOSFETs; Pricing 1: 1=2.97000, 10=2.67000, 25=2.52000, 50=2.52000, 100=2.17000, 250=2.10000, 500=1.73000, 1000=1.62000, 2500=1.56000, 10000=1.56000 (USD); Mount: Surface Mount; Number of Pins: 8; Contact Plating: Tin; Min Operating Temperature: -55°C; Max Operating Temperature: 150°C; Packaging: Tape and Reel; Element Configuration: Single; Fall Time: 6ns; Package Quantity: 1; Power Dissipation: 3.1W; Number of Channels: 1; Drain to Source Breakdown Voltage: 100V; Drain to Source Resistance: 4.9mR; Lead Free: Contains Lead; RoHS Compliant: Yes; REACH SVHC: No SVHC; ComponentLink5URL: https://datasheet.ciiva.com/29752/csd19532q5b-29752088.pdf?src-supplier=Digi-Key; ComponentLink5Description: https://datasheet.ciiva.com/29752/csd19532q5b-29752088.pdf?src-supplier=Digi-Key; ComponentLink6URL: https://datasheet.ciiva.com/46430/1857696-46430346.pdf?src-supplier=Element14; ComponentLink6Description: https://datasheet.ciiva.com/46430/1857696-46430346.pdf?src-supplier=Element14; ComponentLink7URL: https://datasheet.ciiva.com/46430/1857696-46430347.pdf?src-supplier=Element14; ComponentLink7Description: https://datasheet.ciiva.com/46430/1857696-46430347.pdf?src-supplier=Element14; ComponentLink8URL: https://datasheet.ciiva.com/29752/csd19532q5b-29752093.pdf?src-supplier=Digi-Key; ComponentLink8Description: https://datasheet.ciiva.com/29752/csd19532q5b-29752093.pdf?src-supplier=Digi-Key; ComponentLink9URL: https://datasheet.ciiva.com/29752/csd19532q5b-29752106.pdf?src-supplier=Digi-Key; ComponentLink9Description: https://datasheet.ciiva.com/29752/csd19532q5b-29752106.pdf?src-supplier=Digi-Key; ComponentLink10URL: https://datasheet.ciiva.com/30021/csd19532q5b-30021946.pdf?src-supplier=Avnet; ComponentLink10Description: https://datasheet.ciiva.com/30021/csd19532q5b-30021946.pdf?src-supplier=Avnet; Supplier Part Number 1: 595-CSD19532Q5B
Q204 = ZXTN25100DG: TRANS NPN 100V 3A SOT223; Manufacturer: Diodes Inc; Max Power Dissipation: 5.3W; Transition Frequency: 175MHz; Collector Base Voltage (VCBO): 180V; Emitter Base Voltage (VEBO): 7V; Number of Elements: 1; Collector Emitter Saturation Voltage: 500mV; Element Configuration: Single; Manufacturer Part Number: ZXTN25100DG; Supplier 1: Arrow Electronics; RoHS: Yes; Category: BJTs; Stock 1: 49000; Pricing 1: 1000=0.25480, 2000=0.22890, 5000=0.21400, 10000=0.21190 (USD); Mount: Surface Mount; Case/Package: SOT-223; Number of Pins: 4; Weight: 0.000282oz; Min Operating Temperature: -55°C; Max Operating Temperature: 150°C; Collector Emitter Voltage (VCEO): 100V; Max Collector Current: 3A; Packaging: Tape and Reel; Collector Emitter Breakdown Voltage: 100V; Max Breakdown Voltage: 100V; Package Quantity: 1000; Frequency: 175MHz; Polarity: NPN; Power Dissipation: 5.3W; Gain Bandwidth Product: 175MHz; Max Frequency: 175MHz; Series: -; Collector-emitter Voltage-Max: 500mV; Length: 6.7mm; Width: 3.7mm; Height: 1.65mm; Radiation Hardening: No; Lead Free: Lead Free; REACH SVHC: No SVHC; RoHS Compliant: Yes; ComponentLink1URL: https://datasheet.ciiva.com/6360/zxtn25100dg-6360033.pdf?src-supplier=Digi-Key; ComponentLink1Description: https://datasheet.ciiva.com/6360/zxtn25100dg-6360033.pdf?src-supplier=Digi-Key; Supplier Part Number 1: ZXTN25100DGTA
Q206-Q208 Q210 = BSS84W: P-Channel 50 V 10 Ohm Enhancement Mode Transistor SOT-323; Manufacturer: Diodes Inc; Continuous Drain Current (ID): 130mA; Turn-Off Delay Time: 18ns; Turn-On Delay Time: 10ns; Gate to Source Voltage (Vgs): 20V; Input Capacitance: 45pF; Max Power Dissipation: 200mW; Rds On Max: 10R; Drain to Source Voltage (Vdss): -50V; Current Rating: -130mA; Drain to Source Resistance: 6R; Element Configuration: Single; Number of Channels: 1; Threshold Voltage: -1.6V; Manufacturer Part Number: BSS84W-7-F; Supplier 1: Arrow Electronics; RoHS: Yes; Category: MOSFETs; Stock 1: 6000; Pricing 1: 3000=0.07350, 6000=0.06460 (USD); Mount: Surface Mount; Case/Package: SOT-323; Number of Pins: 3; Weight: 0.000212oz; Contact Plating: Tin,Matte; Min Operating Temperature: -55°C; Max Operating Temperature: 150°C; Packaging: Tape and Reel; Package Quantity: 3000; Voltage Rating (DC): -50V; Power Dissipation: 200mW; Series: -; Polarity: P-CHANNEL; Number of Elements: 1; On-State Resistance: 10R; Nominal Vgs: -1.6V; Drain-source On Resistance-Max: 10R; Length: 2.2mm; Width: 1.35mm; Height: 1mm; Radiation Hardening: No; RoHS Compliant: Yes; Lead Free: Lead Free; REACH SVHC: No SVHC; ComponentLink1URL: https://datasheet.ciiva.com/19479/1539489-19479838.pdf?src-supplier=Jameco; ComponentLink1Description: https://datasheet.ciiva.com/19479/1539489-19479838.pdf?src-supplier=Jameco; ComponentLink2URL: https://datasheet.ciiva.com/4442/ds30205-79185-4442986.pdf?src-supplier=Mouser; ComponentLink2Description: https://datasheet.ciiva.com/4442/ds30205-79185-4442986.pdf?src-supplier=Mouser; ComponentLink3URL: https://datasheet.ciiva.com/15137/getdatasheetpartid-91759-15137729.pdf?src-supplier=Verical; ComponentLink3Description: https://datasheet.ciiva.com/15137/getdatasheetpartid-91759-15137729.pdf?src-supplier=Verical; ComponentLink4URL: https://datasheet.ciiva.com/8115/ds30205-8115434.pdf?src-supplier=Avnet; ComponentLink4Description: https://datasheet.ciiva.com/8115/ds30205-8115434.pdf?src-supplier=Avnet; ComponentLink5URL: https://datasheet.ciiva.com/17082/bss84w-7-f-17082780.pdf?src-supplier=Allied+Electronics; ComponentLink5Description: https://datasheet.ciiva.com/17082/bss84w-7-f-17082780.pdf?src-supplier=Allied+Electronics; ComponentLink6URL: https://datasheet.ciiva.com/1190/ds30205-1190308.pdf?src-supplier=Element14; ComponentLink6Description: https://datasheet.ciiva.com/1190/ds30205-1190308.pdf?src-supplier=Element14; ComponentLink7URL: https://datasheet.ciiva.com/8115/ds30205-8115325.pdf?src-supplier=Avnet; ComponentLink7Description: https://datasheet.ciiva.com/8115/ds30205-8115325.pdf?src-supplier=Avnet; ComponentLink8URL: https://datasheet.ciiva.com/934/ds30205-934606.pdf?src-supplier=Digi-Key; ComponentLink8Description: https://datasheet.ciiva.com/934/ds30205-934606.pdf?src-supplier=Digi-Key; ComponentLink9URL: https://datasheet.ciiva.com/934/ds30205-934607.pdf?src-supplier=Digi-Key; ComponentLink9Description: https://datasheet.ciiva.com/934/ds30205-934607.pdf?src-supplier=Digi-Key; ComponentLink10URL: https://datasheet.ciiva.com/934/ds30205-934605.pdf?src-supplier=Digi-Key; ComponentLink10Description: https://datasheet.ciiva.com/934/ds30205-934605.pdf?src-supplier=Digi-Key; Supplier Part Number 1: BSS84W-7-F
R201 R202 R205-R212 R214 R216 R217 R219-R224 R226 R227 = R: Generic Resistor; Tolerance: 1%; Voltage Rating: 50V; Power Rating: 62.5mW; Temperature Coefficient: 100ppm/°C; Size Code: 0402
  R201 R212 R214 R223 R224 R227: Resistance: 10k
  R202 R209 R210 R220: Resistance: 100R
  R205: Resistance: 10M
  R206-R208 R216 R217 R226: Resistance: 100k
  R211: Resistance: 220k
  R219: Resistance: 1k
  R221 R222: Resistance: 10R
R204 = R: RES 10K OHM 1% 1/5W 0603; Manufacturer: YAGEO; Manufacturer Part Number: RC0603FR-7W10KL; Voltage Rating: 75V; Power Rating: 0.2W; Temperature Coefficient: 200ppm/°C; Size Code: 0603; Tolerance: 1%; Resistance: 10k
R213 R218 R225 R228 = R: Generic Resistor; Tolerance: 1%; Voltage Rating: 75V; Power Rating: 100mW; Temperature Coefficient: 100ppm/°C; Size Code: 0603
  R213: Resistance: 22k
  R218 R228: Resistance: 47k
  R225: Resistance: 1k
RT201 = B57238S0250M000: NTC Thermistor, 25ohm, Through Hole Mount; Manufacturer: Epcos; Tolerance: 20%; Power: 3.9W; Rated Temperature: 25°C; Thermistor Application: SOFT START; Rated AC Voltage (URac): 265V; Manufacturer Part Number: B57238S0250M000; Supplier 1: Rs; RoHS: Yes; Category: Thermistors; Stock 1: 2155; Pricing 1: 500=0.75700 (GBP); Mounting Technology: Through Hole; Pins: 2; Package Shape: Disk; Terminal Finish: Tin; Min Operating Temperature: -55°C; Max Operating Temperature: 170°C; JESD-609 Code: e3; Resistor Type: NTC THERMISTOR; Packaging: Bulk; Terminal Placement: Radial; Termination: Wire; RoHS Compliant: Yes; Reach SVHC Compliant: No; ComponentLink1URL: https://datasheet.ciiva.com:443/pdfs/VipMasterIC/IC/TDKC/TDKC-S-A0001106310/TDKC-S-A0001106310-1.pdf?src-supplier=IHS+Markit; ComponentLink1Description: https://datasheet.ciiva.com:443/pdfs/VipMasterIC/IC/TDKC/TDKC-S-A0001106310/TDKC-S-A0001106310-1.pdf?src-supplier=IHS+Markit; ComponentLink2URL: http://www.epcos.com/inf/50/db/icl_13/B57238_S238.pdf?src-supplier=Avnet; ComponentLink2Description: http://www.epcos.com/inf/50/db/icl_13/B57238_S238.pdf?src-supplier=Avnet; Supplier Part Number 1: 1857638
U201 = LM393: Comparator Dual 18V/36V 8-Pin TSSOP T/R; Manufacturer: ST; Voltage Gain: 106.02dB; Min Supply Voltage: 2V; Max Supply Voltage: 36V; Min Dual Supply Voltage: 1V; Max Dual Supply Voltage: 18V; Number of Elements: 2; Input Offset Voltage (Vos): 5mV; Input Bias Current: 250nA; Output Current: 18mA; Quiescent Current: 2.5mA; Output Type: TTL; Max Power Dissipation: 625mW; Nominal Supply Current: 1mA; Output Current per Channel: 100pA; Response Time: 1.3us; Natural Thermal Resistance: 120°C/W; Manufacturer Part Number: LM393PT; Supplier 1: Newark; RoHS: Yes; Category: Comparators; Stock 1: 4000; Pricing 1: 1=0.55700, 5=0.55700, 10=0.47600, 25=0.44300, 50=0.37500, 100=0.30600, 250=0.25300, 500=0.20100, 1000=0.16500 (USD); Mount: Surface Mount; Case/Package: TSSOP; Number of Pins: 8; Min Operating Temperature: 0°C; Max Operating Temperature: 70°C; Package Quantity: 1; Packaging: Tape and Reel; Type: General Purpose; Number of Channels: 2; Max Input Current: 250nA; Max Supply Current: 1mA; Power Dissipation: 625mW; Supply Current: 1mA; Series: LM393; Technology: BIPOLAR; Radiation Hardening: No; RoHS Compliant: Yes; Lead Free: Lead Free; ComponentLink1URL: https://datasheet.ciiva.com/15131/getdatasheetpartid-186418-15131021.pdf?src-supplier=Verical; ComponentLink1Description: https://datasheet.ciiva.com/15131/getdatasheetpartid-186418-15131021.pdf?src-supplier=Verical; ComponentLink2URL: https://datasheet.ciiva.com/1827/cd00000465-1827201.pdf?src-supplier=Digi-Key; ComponentLink2Description: https://datasheet.ciiva.com/1827/cd00000465-1827201.pdf?src-supplier=Digi-Key; ComponentLink3URL: https://datasheet.ciiva.com/1827/cd00000465-1827202.pdf?src-supplier=Digi-Key; ComponentLink3Description: https://datasheet.ciiva.com/1827/cd00000465-1827202.pdf?src-supplier=Digi-Key; ComponentLink4URL: https://datasheet.ciiva.com/1827/cd00000465-1827203.pdf?src-supplier=Digi-Key; ComponentLink4Description: https://datasheet.ciiva.com/1827/cd00000465-1827203.pdf?src-supplier=Digi-Key; ComponentLink5URL: https://datasheet.ciiva.com/2971/cd00000465-2971959.pdf?src-supplier=Avnet; ComponentLink5Description: https://datasheet.ciiva.com/2971/cd00000465-2971959.pdf?src-supplier=Avnet; ComponentLink6URL: https://datasheet.ciiva.com/16381/cd00000465-16381559.pdf?src-supplier=Future+Electronics; ComponentLink6Description: https://datasheet.ciiva.com/16381/cd00000465-16381559.pdf?src-supplier=Future+Electronics; Supplier Part Number 1: 69AH0634; Colloquial: LM393